# Altium schematic sheet Peripheral.SchDoc
size A; SheetNumber: 3; SheetTotal: 3
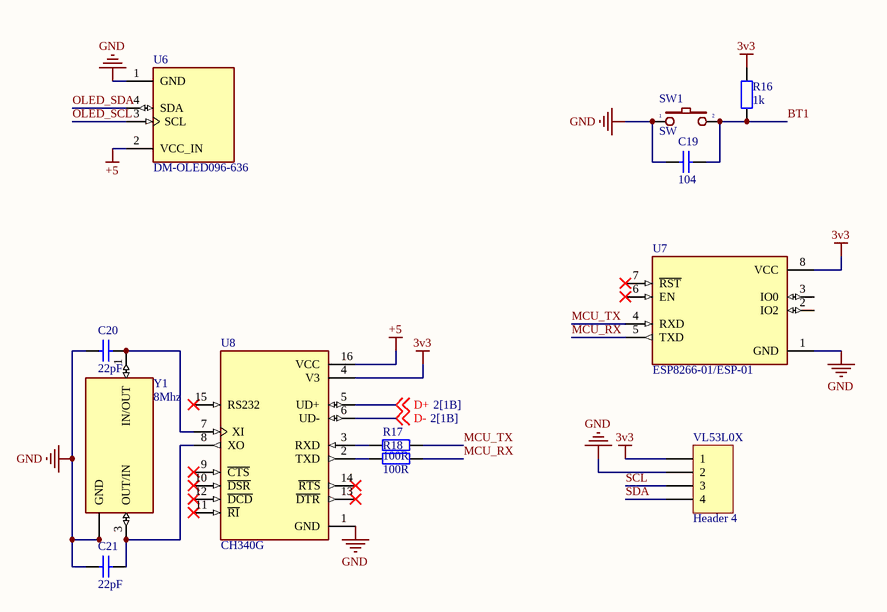
[diagram p0: Peripheral.SchDoc]

## Parts
C19  value 104  [C-NP-0805]  (hidden comment: Cap Non-pol)
C20  value 22pF  [C-NP-0805]  (hidden comment: Cap Non-pol)
C21  value 22pF  [C-NP-0805]  (hidden comment: Cap Non-pol)
R16  value 1k  [DIEN TRO 0805]  (hidden comment: RES_SMD_0805)
R17  value 100R  [DIEN TRO 0805]  (hidden comment: RES_SMD_0805)
R18  value 100R  [DIEN TRO 0805]  (hidden comment: RES_SMD_0805)
SW1  SW  [SW2]
U6  DM-OLED096-636  [MODULE_DM-OLED096-636]
U7  ESP8266-01/ESP-01  [XCVR_ESP8266-01/ESP-01]
U8  CH340G  [SOIC127P600X180-16N]
VL53L0X  Header 4  [Header 4]
Y1  8Mhz  [XTAL_ECS-250-6-33B2-CTN-TR3]

## Nets
3v3: R16.2 U7.8(VCC) U8.4(V3) VL53L0X.1
+5: U6.2(VCC_IN) U8.16(VCC)
GND: C19.2 C20.2 C21.2 SW1.1 U6.1(GND) U7.1(GND) U8.1(GND) VL53L0X.2 Y1.2(GND) Y1.4(GND)
BT1: C19.1 R16.1 SW1.2
D+: U8.5(UD+) ; off-sheet D+
D-: U8.6(UD-) ; off-sheet D-
MCU_RX: R18.2 U7.5(TXD)
MCU_TX: R17.2 U7.4(RXD)
OLED_SCL: U6.3(SCL)
OLED_SDA: U6.4(SDA)
SCL: VL53L0X.3
SDA: VL53L0X.4
NetC20_1: C20.1 U8.7(XI) Y1.1(IN/OUT)
NetC21_1: C21.1 U8.8(XO) Y1.3(OUT/IN)
NetR17_1: R17.1 U8.3(RXD)
NetR18_1: R18.1 U8.2(TXD)

Not connected (* = marked no-connect by the designer): U7 2(IO2) 3(IO0) 6(EN)* 7(~{RST})*; U8 9(~{CTS})* 10(~{DSR})* 11(~{RI})* 12(~{DCD})* 13(~{DTR})* 14(~{RTS})* 15(RS232)*

## Library data of the parts
C19-C21 = Cap Non-pol: Non-polarized Capacitor; Published: 8-Jun-2000; LatestRevisionDate: 17-Jul-2002; LatestRevisionNote: Re-released for DXP Platform.; PackageReference: RAD-0.3; Publisher: Altium Limited
R16-R18 = RES_SMD_0805: RES_0805; Published: 8-Jun-2000; LatestRevisionDate: 17-Jul-2002; LatestRevisionNote: Re-released for DXP Platform.; PackageReference: AXIAL-0.4; Publisher: Altium Limited
SW1 = SW2: Switch button 2 pin; Value: SW chip 2 pin
U6 = DM-OLED096-636: 0.96â€ 128 X 64 MONOCHROME GRAPHIC OLED DISPLAY MODULE - I2C; SnapEDA_Link: https://www.snapeda.com/parts/DM-OLED096-636/Display+Module/view-part/?ref=snap; Package: Package; Value: *; MF: Display Module; MP: DM-OLED096-636; Check_prices: https://www.snapeda.com/parts/DM-OLED096-636/Display+Module/view-part/?ref=eda
U7 = ESP8266-01/ESP-01: MakerFocus 4pcs ESP8266 ESP-01 Serial Wireless WiFi Transceiver Receiver Module 1MB SPI Flash DC3.0-3.6V Internet of Things WiFi Module Board Compatible with Ar duino; Value: *; MP: ESP8266-01/ESP-01; Package: None; Availability: Unavailable; Price: None
U8 = CH340G: USB Interface Integrated Circuit; MF: WCH; Value: *; SnapEDA_Link: https://www.snapeda.com/parts/Ch340G/WCH/view-part/?ref=snap; MP: Ch340G; Check_prices: https://www.snapeda.com/parts/Ch340G/WCH/view-part/?ref=eda; Availability: Not in stock; Price: None; Package: None
VL53L0X = Header 4: Header, 4-Pin; LatestRevisionDate: 17-Jul-2002; LatestRevisionNote: Re-released for DXP Platform.; Publisher: Altium Limited
Y1 = ECS-250-6-33B2-CTN-TR3: Package: None; Price: None; Value: *; MP: ECS-250-6-33B2-CTN-TR3; Availability: Unavailable